# Altium project GatewayLoRa.PrjPcb
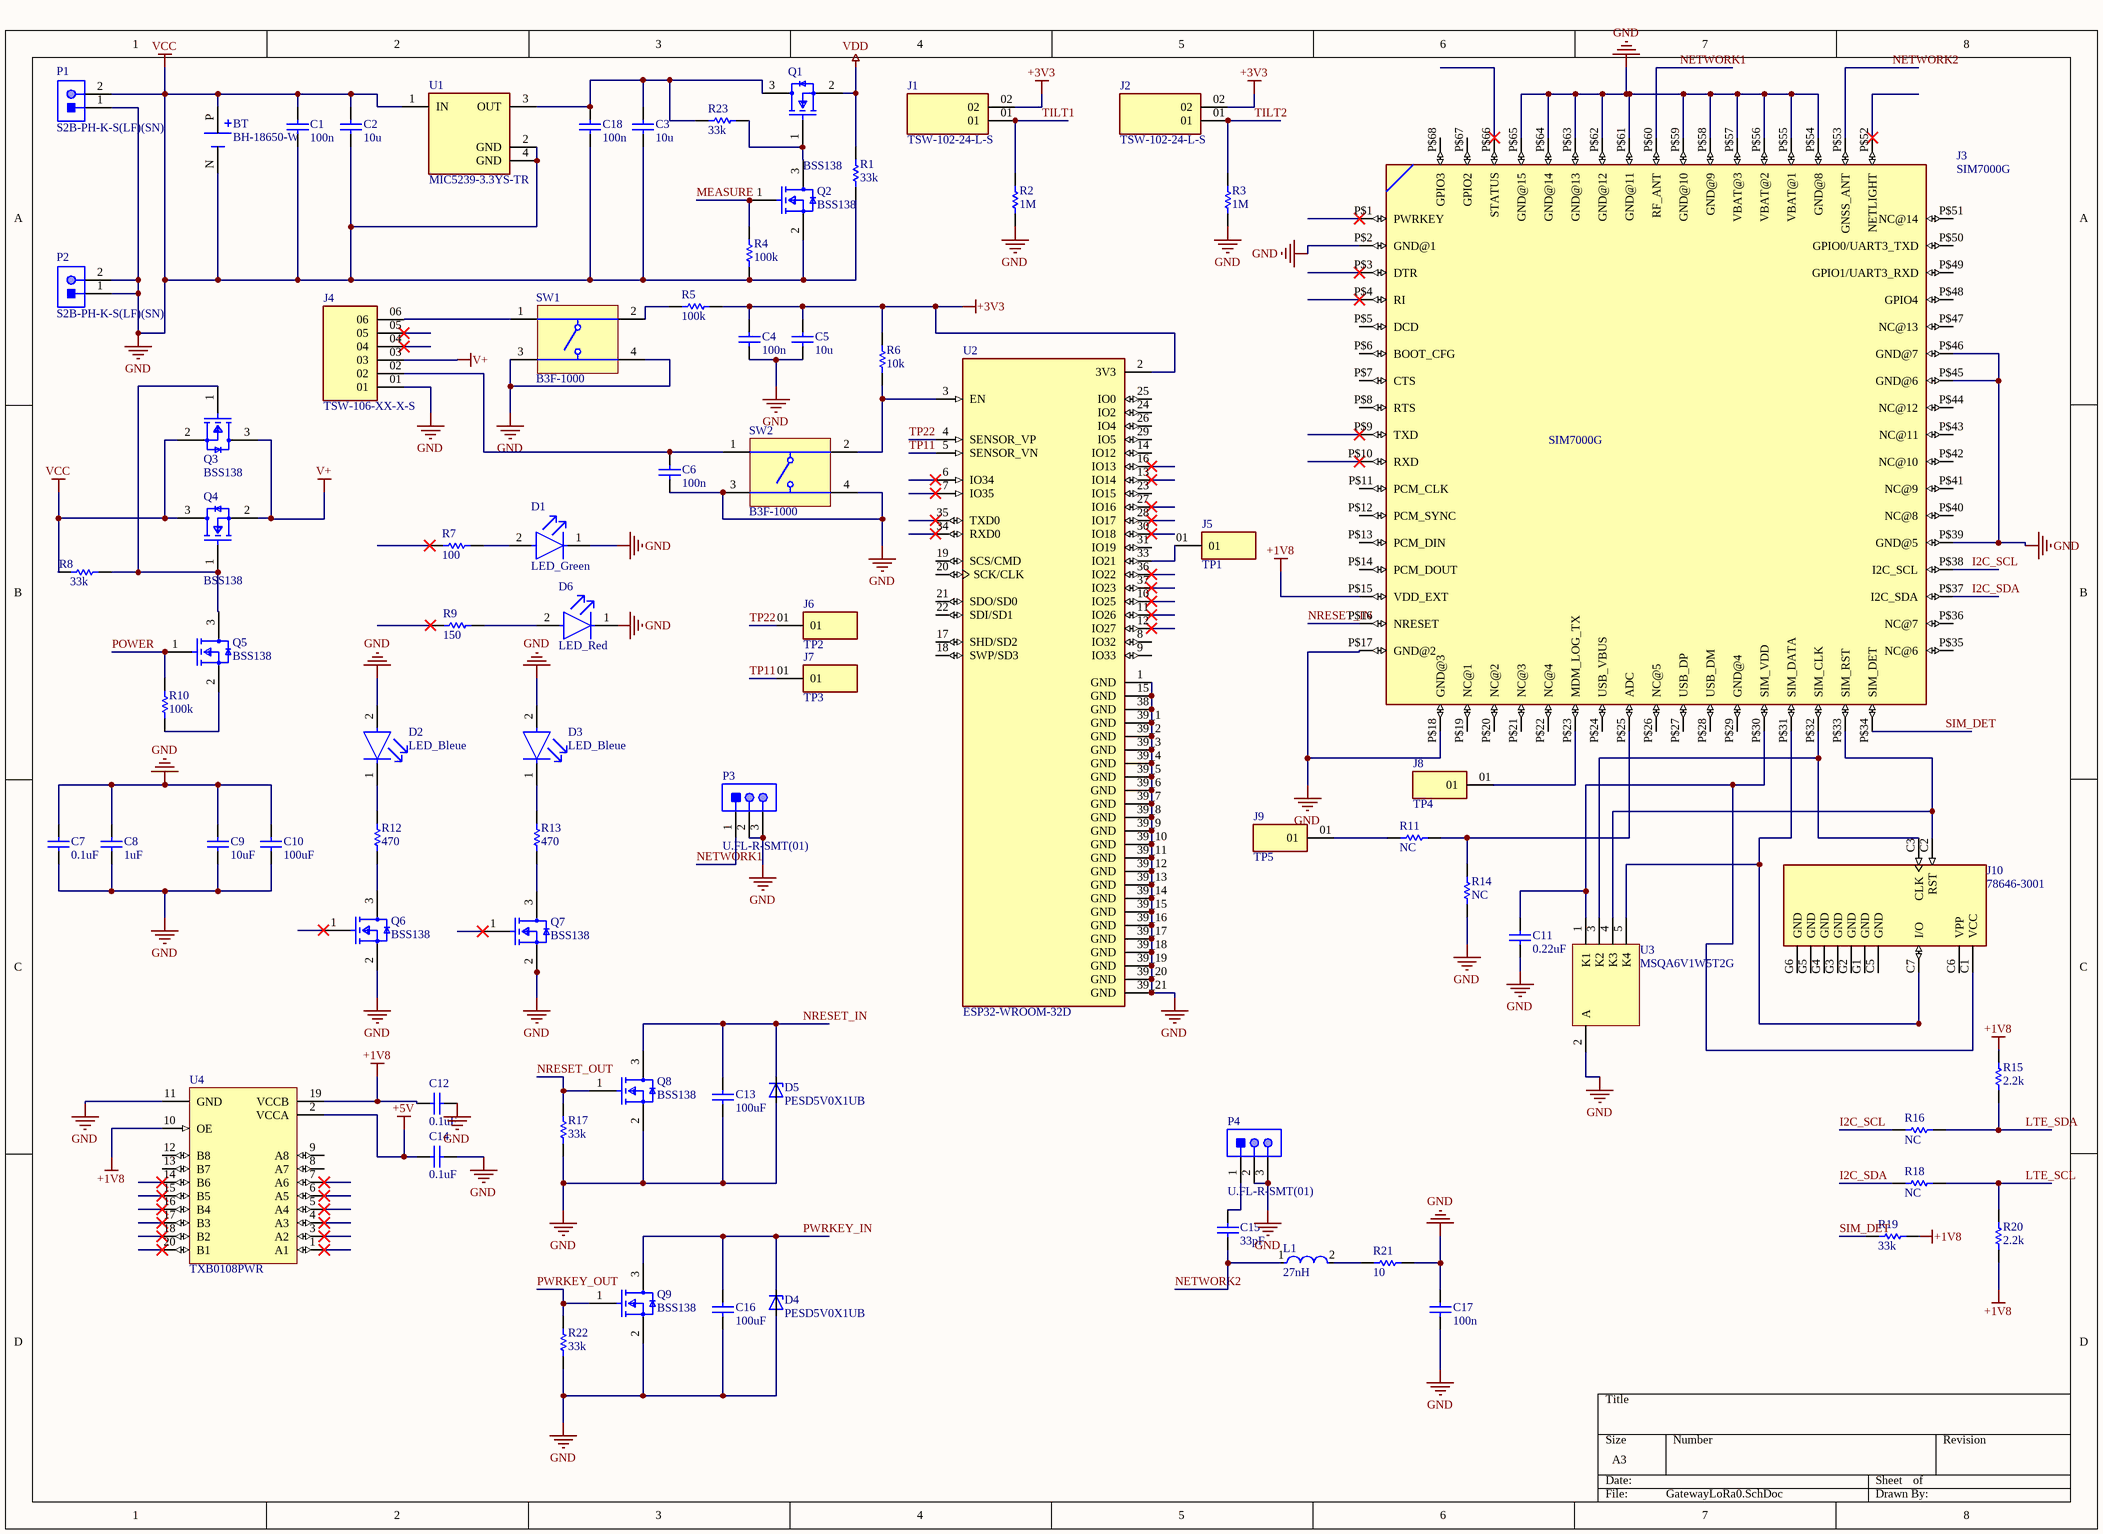
[diagram p0: GatewayLoRa0.SchDoc]
1 sheet, 78 parts. Net scope: global (net labels, ports and power ports of the same name join across sheets).
Board file: GatewayLoRa.PcbDoc

## Sheet GatewayLoRa0.SchDoc
size A3; SheetNumber: 1; SheetTotal: 1

### Parts
BT  BH-18650-W  [BAT_BH-18650-W]
C1  100n  [CAPC1210(3225)280_L]
C2  10u  [CAPC1210(3225)280_L]
C3  10u  [CAPC1210(3225)280_L]
C4  100n  [CAPC1210(3225)280_L]
C5  10u  [CAPC1210(3225)280_L]
C6  100n  [CAPC1210(3225)280_L]
C7  0.1uF  [CAPC1210(3225)280_L]
C8  1uF  [CAPC1210(3225)280_L]
C9  10uF  [CAPC1210(3225)280_L]
C10  100uF  [CAPC1210(3225)280_L]
C11  0.22uF  [CAPC1210(3225)280_L]
C12  0.1uF  [CAPC1210(3225)280_L]
C13  100uF  [CAPC1210(3225)280_L]
C14  0.1uF  [CAPC1210(3225)280_L]
C15  33pF  [CAPC1210(3225)280_L]
C16  100uF  [CAPC1210(3225)280_L]
C17  100n  [CAPC1210(3225)280_L]
C18  100n  [CAPC1210(3225)280_L]
D1  LED_Green  [FP-LTST-C191KGKT-MFG]
D2  LED_Bleue  [FP-LTST-C193TBKT-5A-MFG]
D3  LED_Bleue  [FP-LTST-C193TBKT-5A-MFG]
D4  PESD5V0X1UB  [SOD523]
D5  PESD5V0X1UB  [SOD523]
D6  LED_Red  [FP-SML-P11UTT86-MFG]
J1  TSW-102-24-L-S  [SAMTEC_TSW-102-24-L-S]
J2  TSW-102-24-L-S  [SAMTEC_TSW-102-24-L-S]
J3  SIM7000G  [SIM7000G]
J4  TSW-106-XX-X-S  [SAMTEC_TSW-106-XX-X-S]
J5  TP1  [SAMTEC_TSW-101-07-L-S]
J6  TP2  [SAMTEC_TSW-101-07-L-S]
J7  TP3  [SAMTEC_TSW-101-07-L-S]
J8  TP4  [SAMTEC_TSW-101-07-L-S]
J9  TP5  [SAMTEC_TSW-101-07-L-S]
J10  78646-3001  [MOLEX_78646-3001]
L1  27nH  [FP-LQM21PH_G0-IPC_C]
P1  S2B-PH-K-S(LF)(SN)  [JST-S2B-PH-K-S_V]
P2  S2B-PH-K-S(LF)(SN)  [JST-S2B-PH-K-S_V]
P3  U.FL-R-SMT(01)  [HRS-U.FL-R-SMT(10)_V]
P4  U.FL-R-SMT(01)  [HRS-U.FL-R-SMT(10)_V]
Q1  BSS138  [FP-318-08-IPC_B]
Q2  BSS138  [FP-318-08-IPC_B]
Q3  BSS138  [FP-318-08-IPC_B]
Q4  BSS138  [FP-318-08-IPC_B]
Q5  BSS138  [FP-318-08-IPC_B]
Q6  BSS138  [FP-318-08-IPC_B]
Q7  BSS138  [FP-318-08-IPC_B]
Q8  BSS138  [FP-318-08-IPC_B]
Q9  BSS138  [FP-318-08-IPC_B]
R1  33k  [RESC3216X60X45LL10T20]
R2  1M  [RESC3216X60X45LL10T20]
R3  1M  [RESC3216X60X45LL10T20]
R4  100k  [RESC3216X60X45LL10T20]
R5  100k  [RESC3216X60X45LL10T20]
R6  10k  [RESC3216X60X45LL10T20]
R7  100  [RESC3216X60X45LL10T20]
R8  33k  [RESC3216X60X45LL10T20]
R9  150  [RESC3216X60X45LL10T20]
R10  100k  [RESC3216X60X45LL10T20]
R11  NC  [RESC3216X60X45LL10T20]
R12  470  [RESC3216X60X45LL10T20]
R13  470  [RESC3216X60X45LL10T20]
R14  NC  [RESC3216X60X45LL10T20]
R15  2.2k  [RESC3216X60X45LL10T20]
R16  NC  [RESC3216X60X45LL10T20]
R17  33k  [RESC3216X60X45LL10T20]
R18  NC  [RESC3216X60X45LL10T20]
R19  33k  [RESC3216X60X45LL10T20]
R20  2.2k  [RESC3216X60X45LL10T20]
R21  10  [RESC3216X60X45LL10T20]
R22  33k  [RESC3216X60X45LL10T20]
R23  33k  [RESC3216X60X45LL10T20]
SW1  B3F-1000  [OMRON-B3F-1000-4_V]
SW2  B3F-1000  [OMRON-B3F-1000-4_V]
U1  MIC5239-3.3YS-TR  [FP-SOT223-3LD-PL-1-MFG]
U2  ESP32-WROOM-32D  [MODULE_ESP32-WROOM-32D]
U3  MSQA6V1W5T2G  [ONSC-SC70-5-419A-02_V]
U4  TXB0108PWR  [PW0020A_L]

### Nets
+1V8: C12.2 J3.P$15(VDD_EXT) R15.2 R19.2 R20.1 U4.10(OE) U4.19(VCCB)
+3V3: C4.2 C5.2 J1.02 J2.02 R5.2 R6.2 U2.2(3V3)
+5V: C14.2 U4.2(VCCA)
GND: BT.N(NEG) BT.P(POS) C1.1 C1.2 C2.1 C2.2 C3.1 C4.1 C5.1 C6.1 C7.1 C7.2 C8.1 C8.2 C9.1 C9.2 C10.1 C10.2 C11.2 C12.1 C13.2 C14.1 C16.2 C17.1 C17.2 C18.1 D1.1(C) D2.2(A) D3.2(A) D4.2(A) D5.2(A) J3.P$2(GND@1) J3.P$17(GND@2) J3.P$18(GND@3) J3.P$39(GND@5) J3.P$45(GND@6) J3.P$46(GND@7) J3.P$54(GND@8) J3.P$55(VBAT@1) J3.P$56(VBAT@2) J3.P$57(VBAT@3) J3.P$58(GND@9) J3.P$59(GND@10) J3.P$61(GND@11) J3.P$62(GND@12) J3.P$63(GND@13) J3.P$64(GND@14) J3.P$65(GND@15) J4.01 P1.1 P1.2 P2.1 P2.2 P3.2 P3.3 P4.2 P4.3 Q2.2(S) Q3.2(S) Q4.3(D) Q6.2(S) Q7.2(S) Q8.2(S) Q9.2(S) R1.1 R2.1 R3.1 R4.1 R8.1 R14.1 R17.1 R21.2 R22.1 SW1.3 SW1.4 SW2.3 SW2.4 U1.1(IN) U1.2(GND) U1.4(GND) U2.1(GND) U2.15(GND) U2.38(GND) U2.39_1(GND) U2.39_2(GND) U2.39_3(GND) U2.39_4(GND) U2.39_5(GND) U2.39_6(GND) U2.39_7(GND) U2.39_8(GND) U2.39_9(GND) U2.39_10(GND) U2.39_11(GND) U2.39_12(GND) U2.39_13(GND) U2.39_14(GND) U2.39_15(GND) U2.39_16(GND) U2.39_17(GND) U2.39_18(GND) U2.39_19(GND) U2.39_20(GND) U2.39_21(GND) U3.2(A) U4.11(GND)  [also labelled VCC]
V+: J4.03 Q3.3(D) Q4.2(S)
VDD: Q1.2(S) R1.2
I2C_SCL: J3.P$38(I2C_SCL) R16.1
I2C_SDA: J3.P$37(I2C_SDA) R18.1
LTE_SCL: R18.2 R20.2
LTE_SDA: R15.1 R16.2
MEASURE: Q2.1(G) R4.2
NETWORK1: J3.P$60(RF_ANT) P3.1
NETWORK2: C15.2 J3.P$53(GNSS_ANT) L1.1
NRESET_IN: C13.1 D5.1(K) J3.P$16(NRESET) Q8.3(D)
NRESET_OUT: Q8.1(G) R17.2
POWER: Q5.1(G) R10.2
PWRKEY_IN: C16.1 D4.1(K) Q9.3(D)
PWRKEY_OUT: Q9.1(G) R22.2
SIM_DET: J3.P$34(SIM_DET) R19.1
TILT1: J1.01 R2.2
TILT2: J2.01 R3.2
TP11: J7.01 U2.5(SENSOR_VN)
TP22: J6.01 U2.4(SENSOR_VP)
NetC3_2: C3.2 C18.2 Q1.3(D) R23.1 U1.3(OUT)
NetC6_2: C6.2 J4.02 SW2.1
NetC11_1: C11.1 J3.P$30(SIM_VDD) J10.C1(VCC) U3.1(K1)
NetC15_1: C15.1 P4.1
NetD1_2: D1.2(A) R7.2
NetD2_1: D2.1(C) R12.2
NetD3_1: D3.1(C) R13.2
NetD6_2: D6.2(A) R9.2
NetJ3_P$23: J3.P$23(MDM_LOG_TX) J8.01
NetJ3_P$25: J3.P$25(ADC) R11.2 R14.2
NetJ3_P$31: J3.P$31(SIM_DATA) J10.C7(I/O) U3.5(K4)
NetJ3_P$32: J3.P$32(SIM_CLK) J10.C3(CLK) U3.3(K2)
NetJ3_P$33: J3.P$33(SIM_RST) J10.C2(RST) U3.4(K3)
NetJ4_06: J4.06 SW1.1
NetJ5_01: J5.01 U2.33(IO21)
NetJ9_01: J9.01 R11.1
NetL1_2: L1.2 R21.1
NetQ1_1: Q1.1(G) Q2.3(D) R23.2
NetQ3_1: Q3.1(G) Q4.1(G) Q5.3(D) R8.2
NetQ5_2: Q5.2(S) R10.1
NetQ6_3: Q6.3(D) R12.1
NetQ7_3: Q7.3(D) R13.1
NetR5_1: R5.1 SW1.2
NetR6_1: R6.1 SW2.2 U2.3(EN)

Not connected (* = marked no-connect by the designer): D6 1(C); J3 P$1(PWRKEY)* P$3(DTR)* P$4(RI)* P$5(DCD) P$6(BOOT_CFG) P$7(CTS) P$8(RTS) P$9(TXD)* P$10(RXD)* P$11(PCM_CLK) P$12(PCM_SYNC) P$13(PCM_DIN) P$14(PCM_DOUT) P$19(NC@1) P$20(NC@2) P$21(NC@3) P$22(NC@4) P$24(USB_VBUS) P$26(NC@5) P$27(USB_DP) P$28(USB_DM) P$29(GND@4) P$35(NC@6) P$36(NC@7) P$40(NC@8) P$41(NC@9) P$42(NC@10) P$43(NC@11) P$44(NC@12) P$47(NC@13) P$48(GPIO4) P$49(GPIO1/UART3_RXD) P$50(GPIO0/UART3_TXD) P$51(NC@14) P$52(NETLIGHT)* P$66(STATUS)* P$67(GPIO2) P$68(GPIO3); J4 04* 05*; J10 C5(GND) C6(VPP) G1(GND) G2(GND) G3(GND) G4(GND) G5(GND) G6(GND); Q6 1(G)*; Q7 1(G)*; R7 1*; R9 1*; U2 6(IO34)* 7(IO35)* 8(IO32) 9(IO33) 10(IO25)* 11(IO26)* 12(IO27)* 13(IO14)* 14(IO12) 16(IO13)* 17(SHD/SD2) 18(SWP/SD3) 19(SCS/CMD) 20(SCK/CLK) 21(SDO/SD0) 22(SDI/SD1) 23(IO15) 24(IO2) 25(IO0) 26(IO4) 27(IO16)* 28(IO17)* 29(IO5) 30(IO18)* 31(IO19) 34(RXD0)* 35(TXD0)* 36(IO22)* 37(IO23)*; U4 1(A1)* 3(A2)* 4(A3)* 5(A4)* 6(A5)* 7(A6)* 8(A7) 9(A8) 12(B8) 13(B7) 14(B6)* 15(B5)* 16(B4)* 17(B3)* 18(B2)* 20(B1)*

### Library data of the parts
BT = BH-18650-W: BATTERY HOLDER 18650 6 LEADS; MF: MPD; SnapEDA_Link: https://www.snapeda.com/parts/BH-18650-W/MPD/view-part/4389105/?ref=snap; MP: BH-18650-W; Price: None; Availability: Unavailable; Value: *; Package: None
C1-C18 = CMP-1038-02268-1: CAP 22uF 10V ±10% 1210 (3225 Metric) Thickness 2.8mm SMD; Case-Metric: 3225; Case-EIA: 1210; Tolerance: Â±10%; Max Thickness: 2.8 mm; Value: 22uF; Technology: SMT; Rated Voltage: 10 V
D1 = CMP-2000-05198-2: LED GREEN CLEAR SMD; Max Power Dissipation: 75mW; Forward Current: 30mA; Reverse Voltage: 5V; Lens Color: Colorless; Forward Voltage: 2V; Dominant Wavelength: 571nm; Number of LEDs: 1; Viewing Angle: 130°; Lens Style: Rectangular; Test Current: 20mA; Luminous Intensity: 35mcd; Wavelength: 574nm; Width: 0.8mm; Case Code (Imperial): 0603; Number of Pins: 2; Lead Free: Lead Free; Packaging: Tape and Reel; Package Quantity: 1; Min Operating Temperature: -55°C; Case/Package: 0603; Length: 1.6mm; Power Dissipation: 75mW; Depth: 0.8mm; Radiation Hardening: No; Mount: Surface Mount; Max Operating Temperature: 85°C; Color: Green; Power Rating: 75mW; Height: 0.55mm; Illumination Color: Green; Case Code (Metric): 1608; Lens Transparency: Clear; Number of Elements: 1
D2 D3 = CMP-2000-06624-2: LED BLUE CLEAR CHIP SMD; Number of Elements: 1; Forward Voltage: 2.8V; Forward Current: 20mA; Test Current: 5mA; Lens Color: Colorless; Dominant Wavelength: 475nm; Reverse Voltage: 5V; Viewing Angle: 130°; Lens Style: Diffused; Luminous Intensity: 15mcd; Power Dissipation: 76mW; Max Operating Temperature: 80°C; Length: 1.6mm; Number of LEDs: 1; Case/Package: 0603; Case Code (Metric): 1608; Number of Pins: 2; Radiation Hardening: No; Min Operating Temperature: -20°C; Width: 0.8mm; Packaging: Tape and Reel; Package Quantity: 1; Lead Free: Lead Free; Lens Transparency: Clear; Illumination Color: Blue; Color: Blue; RoHS Compliant: Yes; Mount: Surface Mount; Depth: 0.8mm; Case Code (Imperial): 0603; Height: 0.35mm
D4 D5 = PESD5V0X1UB: 8V _Typ_ Clamp 1.5A _8/20Âµs_ Ipp Tvs Diode Surface Mount SOD-523; MF: NXP Semiconductors; MP: PESD5V0X1UB; Price: None; SnapEDA_Link: https://www.snapeda.com/parts/PESD5V0X1UB/NXP%20Semiconductors/view-part/4219816/?ref=snap; Package: SOD-523 NXP Semiconductors; Value: *; Availability: Unavailable
D6 = CMP-08952-000028-1: LED RED CLEAR 1006 SMD; Number of LEDs: 1; Lens Color: Colorless; Viewing Angle: 150°; Dominant Wavelength: 621nm; Luminous Intensity: 5.5mcd; Forward Voltage: 1.8V; Lens Style: Square; Test Current: 1mA; Forward Current: 20mA; Height: 0.25mm; Radiation Hardening: No; Color: Red; Case Code (Metric): 1005; Number of Pins: 2; RoHS Compliant: Yes; Max Operating Temperature: 85°C; Package Quantity: 1; Wavelength: 621nm; Lens Transparency: Clear; Packaging: Tape and Reel; Lead Free: Lead Free; Illumination Color: Red; Case/Package: 0402; Case Code (Imperial): 0402; Mount: Surface Mount; Min Operating Temperature: -40°C; Width: 0.6mm; Length: 1mm; Series: PicoLED™; REACH SVHC: No SVHC
J1 J2 = TSW-102-24-L-S: Connector Header Through Hole 2 position 0.100 (2.54mm); MF: Samtec; SnapEDA_Link: https://www.snapeda.com/parts/TSW-102-24-L-S/Samtec%20Inc./view-part/930762/?ref=snap; Package: None; Availability: Bad; Price: None; Toby_UK-Purchase-URL: https://snapeda.com/shop?store=Toby+UK&id=930762; MP: TSW-102-24-L-S; Value: *
J3 = SIM7000G: 802.15.4 Cat-M, Cat-NB, EDGE, GPRS, LPWA Transceiver Module 850MHz, 900MHz, 1.8GHz, 1.9GHz Antenna Not Included Surface Mount; MF: SIMCom Wireless Solutions Limited; Package: None; Price: None; Check_prices: https://www.snapeda.com/parts/SIM7000G/SIMCom/view-part/?ref=eda; Value: *; SnapEDA_Link: https://www.snapeda.com/parts/SIM7000G/SIMCom/view-part/?ref=snap; MP: SIM7000G; Availability: In Stock; Purchase-URL: https://pricing.snapeda.com/search?q=SIM7000G&ref=eda
J4 = TSW-106-XX-X-S: TSW - Samtec 2.54mm Pin Header 10.92mm Overall Pin Length (07) - Fast Stock; MF: Samtec Inc.; Availability: Unavailable; Package: None; Price: None; Value: *; MP: TSW-106-XX-X-S
J5-J9 = TSW-101-07-L-S: <a href="https://pricing.snapeda.com/parts/TSW-101-07-L-S/Samtec/view-part?ref=eda">Check availability</a>; MF: Samtec Inc.; Package: None; Price: None; Value: *; MP: TSW-101-07-L-S; Availability: Unavailable
J10 = 78646-3001: 6 Position Card Connector Micro SIM Surface Mount, Right Angle Gold; MF: Molex; Check_prices: https://www.snapeda.com/parts/78646-3001/Molex/view-part/?ref=eda; Value: *; Availability: In Stock; MP: 78646-3001; Price: None; Package: None; SnapEDA_Link: https://www.snapeda.com/parts/78646-3001/Molex/view-part/?ref=snap
L1 = CMP-06042-017027-1: Multilayer Type Inductor for Power Lines, 0805 (2012), 1μH, 30%, 0.0825Ω, 1.3A; Test Frequency: 1MHz; Shielding: Shielded; Self Resonant Frequency: 50MHz; DC Resistance (DCR): 82.5mR; Inductance: 1uH; Core Material: Ferrite; Inductance Tolerance: 30%; Military Standard: Not; Height - Seated (Max): 0.039inch; Max DC Current: 1.3A; Depth: 1.4mm; Packaging: Tape and Reel; Mount: Surface Mount; Width: 0.049inch; Case Code (Imperial): 0805; RoHS Compliant: Yes; Height: 0.9mm; Case/Package: 0805; Max Operating Temperature: 125°C; Min Operating Temperature: -55°C; REACH SVHC: No SVHC; DC Current: 1.3A; Current Rating: 1.3A; Weight: 0.000194oz; Case Code (Metric): 2012; Termination: SMD/SMT; Length: 2mm; Series: LQM21PN_GR; Tolerance: 30%; Package Quantity: 4000
P1 P2 = CMP-1755-00004-1: Male Header, Pitch 2 mm, 1 x 2 Position, Height 4.8 mm, Tail Length 3.4 mm, -25 to 85 degC, RoHS, Bulk; Case\Package: Radial; Tolerance: 20%; Capacitance: 10 uF; Voltage Rating (DC): 50 V; Packaging: Bulk; ComponentLink1URL: http://www.jst-mfg.com/product/pdf/eng/ePH.pdf; Radiation Hardening: No; Height: 11 mm; Package Quantity: 200; PackageDescription: Male Header, Pitch 2 mm, 1 x 2 Position, Height 4.8 mm, Tail Length 3.4 mm; PackageReference: S2B-PH-K-S; Diameter: 5 mm; Pins: 2; Mount: Through Hole; Max Operating Temperature: 85 degC; Min Operating Temperature: -40 degC; ComponentLink1Description: Datasheet; DatasheetVersion: Dec-12; Length: 11 mm; Lead Pitch: 2 mm; REACH SVHC: No SVHC; Voltage Rating: 50 V; RoHSCompliant: true
P3 P4 = CMP-2000-05151-1: CONN RECPT ULTRA-MINI COAX SMD; Manufacturer: Hirose Electric; Centre Contact Resistance: 25mohm; Voltage Rating V AC: 60V; Female Contact Material: PhosphorBronze; Contact Resistance: 10mohm; Male Contact Material: Brass; Connector Type: UFLCoaxial; Connector Mounting: PCB; Impedance: 50ohm; Insulation Resistance: 500Mohm; Secondary Insulation Material: PBT; Frequency Max: 6GHz; Body Plating: Silver; External Length / Height: 2.5mm; Approval Category: UL94V-0; Female Contact Plating: Gold; Connector Mounting Orientation: PCBoard; VSWR: 1.3; Coaxial Termination: Solder; Body Style: StraightJack; SVHC: NoSVHC(18-Jun-2012); Jacket Material: LCP; Package Reference: U.FL-R-SMT(10); Datasheet Version: Feb-04; Outer Contact Resistance: 10mohm; Contact Plating: Gold; Mounting Type: PCBoard; Flammability Rating: UL94V-0; Operating Frequency Max: 6GHz; Termination Method: Solder; Male Contact Plating: Gold; Package Description: 3-Pin Surface Mount Device, Body 2.6 x 2.6 mm; Operating Temperature Min: -40degC; Manufacturer URL: https://www.hirose.com; Operating Temperature Max: 90degC; Contact Material: PhosphorBronze; Datasheet URL: http://www.farnell.com/datasheets/91524.pdf; Material: PhosphorBronze
Q1-Q9 = CMP-07173-000101-1: MOSFET N-CH 50V 220MA SOT-23; Turn-Off Delay Time: 20ns; Element Configuration: Single; Rds On Max: 3.5R; Gate to Source Voltage (Vgs): 20V; Threshold Voltage: 1.3V; Number of Elements: 1; Power Dissipation: 360mW; Rise Time: 9ns; Turn-On Delay Time: 2.5ns; Input Capacitance: 27pF; On-State Resistance: 6R; Lead Free: Lead Free; Length: 2.92mm; Width: 1.3mm; Drain to Source Breakdown Voltage: 50V; Min Operating Temperature: -55°C; REACH SVHC: No SVHC; Packaging: Tape and Reel; Radiation Hardening: No; Height: 0.93mm; Drain to Source Voltage (Vdss): 50V; Current Rating: 220mA; Voltage Rating (DC): 50V; Weight: 0.03g; Continuous Drain Current (ID): 220mA; Number of Pins: 3; Nominal Vgs: 1.3V; Max Power Dissipation: 360mW; Fall Time: 9ns; Drain to Source Resistance: 3.5R; Contact Plating: Tin; Case/Package: SOT-23; Package Quantity: 1; Dual Supply Voltage: 50V; Mount: Surface Mount; Termination: SMD/SMT; Max Operating Temperature: 150°C
R1-R23 = CMP-2003-02263-1: Manufacturer: Vishay Dale; Part Number: CRCW120651R0FKEA
SW1 SW2 = CMP-1677-00002-1: Tactile Switch, SPST-NO, 0.05 A, 5 to 24 V, -25 to 70 degC, 4-Pin THD, RoHS, Bulk; Shielding: Shielded; Gender: Female; Capacitance: -45 f; Voltage Rating: 150 V; Current Rating: 1.5 A; Radiation Hardening: No; Contact Plating: Gold; Height: 14.99 mm; Min Operating Temperature: -40 degC; Packaging: Tray; ComponentLink2Description: Datasheet; ComponentLink1URL: http://www.omron.com/; Lead Pitch: 1.27 mm; RoHSCompliant: true; Pins: 8; PackageReference: B3F-1000; Width: 25.4 mm; Contact Material: Brass; ComponentLink2URL: http://www.omron.com/ecb/products/pdf/en-b3f.pdf; PackageDescription: 4-Pin Through Hole Device, Body 6 x 6 mm; DatasheetVersion: Jan-15; ComponentLink1Description: Manufacturer URL; Package Quantity: 1080; Mount: Through Hole; Length: 18.34 mm; Max Operating Temperature: 70 degC
U1 = CMP-06324-000012-1: IC REG LINEAR 3.3V 500MA SOT223; Manufacturer: Microchip; Standoff Height: 0.02mm; Max Supply Voltage: 30V; Number Of Outputs: 1; Accuracy Percentage: 1%; Output Type: Fixed; Dropout Voltage: 350mV; Nominal Supply Current: 23-8500uA; Max Junction Temp: +125°C; Package: SOT223-3LD-PL-1; Category: IC; Device Class L2: Power Management ICs; Mouser Description: LDO Voltage Regulators High Vin, Low Iq Regulator (Lead Free); Height: 1.8mm; ComponentLink2Description: Datasheet; ComponentLink2URL: http://ww1.microchip.com/downloads/en/DeviceDoc/mic5239.pdf; Temperature: -40°C to +125°C; Output Voltage: 3.3V; Ipc Land Pattern Name: SOT230P700X180-4; Octopart: https://octopart.com/mic5239-3.3ys-tr-microchip-66802369; Device Class L3: Voltage Regulators - Linear; Output Current: 500mA; Digikey Description: IC REG LINEAR 3.3V 500MA SOT223; Temperature Range High: +125°C; Automotive: No; Device Class L1: Integrated Circuits (ICs); Manufacturer Part Number: MIC5239-3.3YS-TR; Temperature Range Low: -40°C; Footprint Url: https://ww1.microchip.com/downloads/en/PackagingSpec/00000049CE.pdf; Lead Free: Yes; RoHS: TRUE
U2 = ESP32-WROOM-32D: Bluetooth, WiFi 802.11b/g/n, Bluetooth v4.2 +EDR, Class 1, 2 and 3 Transceiver Module 2.4GHz ~ 2.5GHz Integrated; MF: Espressif Systems; Price: None; Availability: In Stock; Package: Module Espressif Systems; MP: ESP32-WROOM-32D; Value: *; SnapEDA_Link: https://www.snapeda.com/parts/ESP32-WROOM-32D/Espressif+Systems/view-part/?ref=snap; Purchase-URL: https://pricing.snapeda.com/search/part/ESP32-WROOM-32D/?ref=eda; Check_prices: https://www.snapeda.com/parts/ESP32-WROOM-32D/Espressif+Systems/view-part/?ref=eda
U3 = CMP-1063-00034-1: Quad Array ESD Protection Diodes with Low Clamping Voltage, 5-Pin SC70, Pb-Free, Tape and Reel; Manufacturer: On Semiconductor; Number of Lines: 4; IR Max (uA): 1; V(BR) Min (V): 6.1; PPK Max (W): 150; C Max (pF): 90; Direction: Unidirectional; ComponentLink2URL: http://www.onsemi.cn/pub_link/Collateral/MSQA6V1W5T2-D.PDF; ComponentLink2Description: Datasheet; PackageDescription: 5-Pin Small Outline Transistor, Body 2 x 1.25 mm, Pitch 0.65 mm; PartNumber: MSQA6V1W5T2G; PackageReference: SC70-5-419A-02; Packing: Tape and Reel; Mounting Technology: Surface Mount; ComponentLink3Description: Package Specification; RoHS: Pb-Free; PackageVersion: Rev. L, 01/2013; ComponentLink3URL: http://www.onsemi.cn/pub_link/Collateral/419A-02.PDF; DatasheetVersion: Rev. 7; ComponentLink1Description: Manufacturer URL; ComponentLink1URL: http://www.onsemi.com/
U4 = CMP-2000-07337-1: TXB0108 8-Bit Bidirectional Voltage-Level Translator with Auto-Direction Sensing and / +/- 15-kV ESD Protection, 1.2 to 3.6 V, -40 to 85 degC, 20-Pin TSSOP (PW), Green (RoHS & no Sb/Br), Tape and Reel; Manufacturer: Texas Instruments; Propagation Delay (Max): 4ns; Logic Function: Translator,Bidirectional; Input Type: Logic; Package Version: 4040064-5/G, 02/2011; Voltage - Supply: 1.2V~3.6V,1.65V~5.5V; Data Rate: 100Mbps; Other Names: 296-21527-6; Number of Channels: 8; Differential - Input: Output:No/No; Number of Outputs/Channel: 1; Product Training Modules: VoltageLevelTranslation; Dynamic Catalog: TXBSeries; Package Reference: PW20; Package Description: 20-Pin Small Outline Package Integrated Circuit, Body 6.5 x 4.4 mm, Pitch 0.65 mm; Category: IntegratedCircuits(ICs); Datasheet URL: http://www.ti.com/general/docs/lit/getliterature.tsp?genericPartNumber=TXB0108&fileType=pdf; Package / Case: 20-TSSOP(0.173",4.40mmWidth); Family: Logic-Translators; Standard Package: 1; Series: -; Manufacturer URL: http://www.ti.com/; Number of Bits: 8; Package URL: http://www.ti.com/litv/pdf/mpds362; Output Type: Logic; Datasheet Version: Rev. F, 12/2014; Packaging: Digi-Reel®; Operating Temperature: -40°C~85°C; Supplier Device Package: 20-TSSOP; Mounting Technology: SurfaceMount